# EAGLE design AST1026 (EAGLE 6.3)
DATABASE: ./../../../../../Components/TinyCircuits_Part_Database.txt
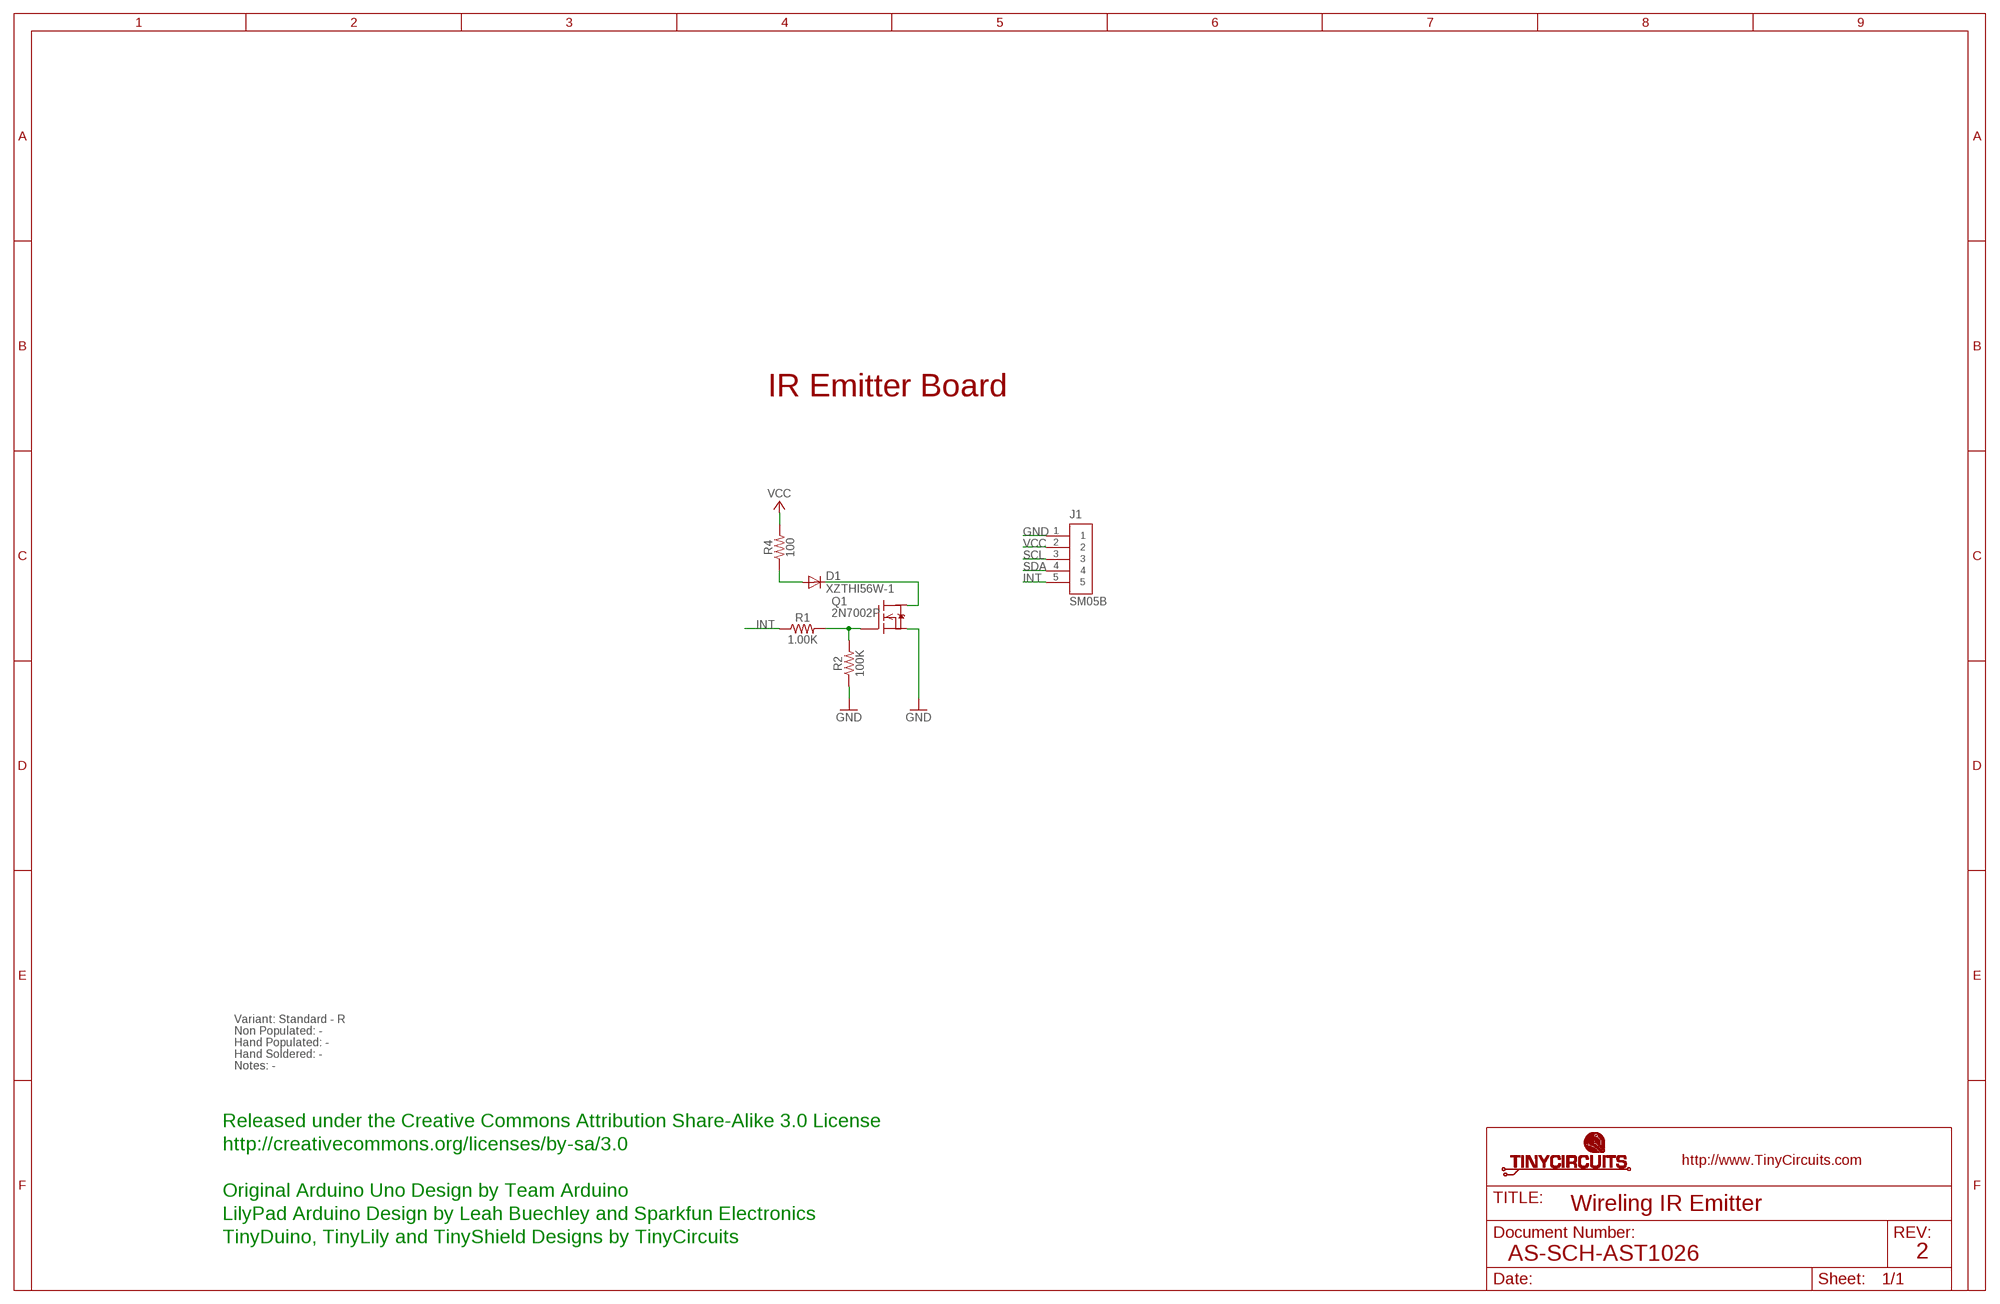
[diagram p0: schematic, sheet 1]

## Parts
D1  XZTHI56W-1  AS-ITM-00551  [LED_SIDE_3.0X1.0]
J1  SM05B  AS-ITM-00340EDGE  [JST_SH_5X1_EDGE]
Q1  2N7002P  AS-ITM-00110  [SOT-416]
R1  1.00K  AS-ITM-00003  [0402]
R2  100K  AS-ITM-00004  [0402]
R4  100  AS-ITM-00210  [0402]

## Nets
GND: J1.1 Q1.2(S) R2.1
INT: J1.5 R1.1
N$1: D1.A R4.1
N$3: D1.C Q1.3(D)
N$4: Q1.1(G) R1.2 R2.2
SCL: J1.3
SDA: J1.4
VCC: J1.2 R4.2

## Notes on the sheet
- IR Emitter Board
- Variant: Standard - R
- Non Populated: -
- Hand Populated: -
- Hand Soldered: -
- Notes: -
- Released under the Creative Commons Attribution Share-Alike 3.0 License
- http://creativecommons.org/licenses/by-sa/3.0
- Original Arduino Uno Design by Team Arduino
- Wireling IR Emitter
- LilyPad Arduino Design by Leah Buechley and Sparkfun Electronics
- TinyDuino, TinyLily and TinyShield Designs by TinyCircuits
- AS-SCH-AST1026 | 2

## Library data of the parts
D1 = tinycircuits:AS-ITM-00551: EMITTER IR 880NM 50MA SMD; PARTNO: AS-ITM-00551
J1 = tinycircuits:AS-ITM-00340: CONN HEADER SH 5POS SIDE 1MM TIN; PARTNO: AS-ITM-00340; PNPROTATION: 180
Q1 = tinycircuits:AS-ITM-00110: MOSFET N-CH SGL 60V SOT-416; PARTNO: AS-ITM-00110; PNPROTATION: 270; VALUE: 2N7002PT
R1 = tinycircuits:AS-ITM-00003: RES 1.00K OHM 1/16W 1% 0402; PARTNO: AS-ITM-00003
R2 = tinycircuits:AS-ITM-00004: RES 100K OHM 1/16W 1% 0402; PARTNO: AS-ITM-00004
R4 = tinycircuits:AS-ITM-00210: RES 100 OHM 1/16W 1% 0402 SMD; PARTNO: AS-ITM-0210

## Net classes
2 gnd: width 0.305 mm, drill 0.559 mm, clearance 0.254 mm

## Board
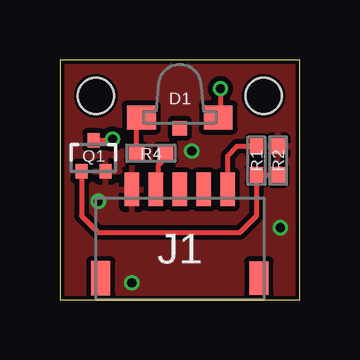
[diagram p1: board, top side]
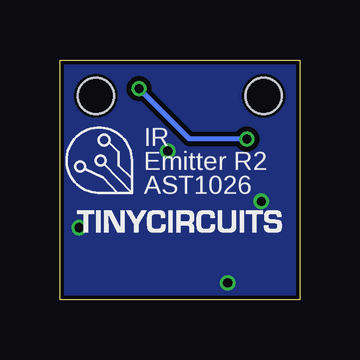
[diagram p2: board, bottom side, seen from below]

Size 10 x 10 mm. Coordinates in mm from the lower left corner, seen from the top.
Outline: 0,0 10,0 10,10 0,10 0,0
Copper layers (1*16): Top 0.035mm / dielectric 1.5mm / Bottom 0.035mm
Design rules "default *": minimum track width 8mil, minimum drill 15mil, track to track 8mil, track to pad 8mil, pad to pad 8mil, via to via 8mil, smd to smd 8mil, copper to edge 6mil, drill to drill 8mil, minimum pad ring 8mil, minimum via ring 5mil, stop-mask expansion 4mil, vias tented up to drill 25mil, thermal gap 10mil
Holes 1.5 mm at 1.5,8.5 8.5,8.5

### Footprints (pad centres in the part's own frame; a part is rotated, then mirrored left to right if it is on the bottom)
LED_SIDE_3.0X1.0 = smd 1.2 x 1: A -1.6,0; C 1.6,0 | smd 0.6 x 0.6: NC 0,-0.45
JST_SH_5X1_EDGE = smd 0.6 x 1.4: 1 -2,2.475; 2 -1,2.475; 3 0,2.475; 4 1,2.475; 5 2,2.475 | smd 0.8 x 1.4: PAD1 -3.3,-1.225; PAD2 3.3,-1.225
SOT-416 = smd 0.5 x 0.6: 1 -0.5,-0.65; 2 0.5,-0.65; 3 0,0.65
0402 = smd 0.65 x 0.55: 1 -0.6,0; 2 0.6,0

### Placement (x,y rotation side)
D1  5,7.6 0 top
J1  5,2.12 0 top
Q1  1.4,6 0 top
R1  8.2,5.8 270 top
R2  9.1,5.8 270 top
R4  3.8,6.1 0 top
U$1  [DOCFIELD-TINYCIRCUITS-PCB]  19,-10 0 top  (outside the outline)

### Tracks (layer width: path | path; a pad name or v marks a point on that pad's centre or on a via)
GND  (via drill 0.38)
  other vias: 1.6,4.1 3,0.7 5.5,6.2 9.2,3
  pour Bottom: 0,10 10,10 10,0 0,0
  pour Top: 0,10 10,10 10,0 0,0
INT
  Top 0.203: J1.5 7,6 7.4,6.4 R1.1
N$1
  Top 0.203: R4.1 3.2,7.4 D1.A
N$3  (via drill 0.38)
  Top 0.203: Q1.3 2.15,6.65 v2.2,6.7 | v6.7,8.8 6.7,7.7 D1.C
  Bottom 0.203: v2.2,6.7 4.6,6.7 v6.7,8.8
N$4
  Top 0.203: Q1.1 0.9,3.5 1.6,2.8 7.5,2.8 8.2,3.5 R1.2 R2.2
VCC
  Top 0.203: R4.2 4.4,5.9 4.1,5.6 4.1,4.7 J1.2

### Text on the board
bPlace: IR | Emitter R2 | AST1026
Document: FABRICATION DRAWING | NOTES: | 1. PRINTED CIRCUIT BOARD MADE FROM NEMA GRADE FR-4 EPOXY LAMINATE | WITH 1 OUNCE COPPER PLATING AND .024 THICKNESS. | 2. ALL DIMENSIONS ARE GIVEN IN MILLIMETERS. | 3. CIRCUIT PATHS ARE FOR REFERENCE ONLY. | 4. HOLE SIZES SHOWN ARE FINISHED DIAMETERS AFTER PLATING. | 5. BOARD PLATED USING REFLOW OR SIMILAR METHOD. | 6. BOARD TO HAVE BLUE SOLDER MASK ON PLATED SURFACES USING WET FILM | 7. SILKSCREEN BOARD USING WHITE INK. | SR100 OR SR1010 EPOXY. EQUIVALENT WET OR DRY FILM MAY BE USED. | 8. THE FOLLOWING INFORMATION APPLIES TO THIS BOARD: | * 2 COPPER LAYERS | * .024 BOARD THICKNESS | * REQUIRES TOP SIDE SILKSCREEN | Released under the Creative Commons Attribution Share-Alike 3.0 License | http://creativecommons.org/licenses/by-sa/3.0 | Original Arduino Uno Design by Team Arduino | LilyPad Arduino Design by Leah Buechley and Sparkfun Electronics | TinyDuino, TinyLily and TinyShield Designs by TinyCircuits | Wireling IR Emitter | AS-PCB-AST1026 | 2